# Altium schematic sheet main.SchDoc
size A4
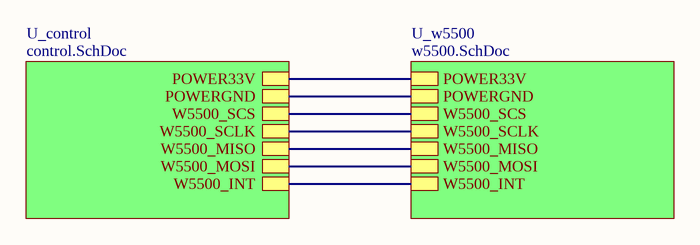
[diagram p0: main.SchDoc]

## Sub-sheets
U_control = control.SchDoc: POWER33V, POWERGND, W5500_INT, W5500_SCS, W5500_SCLK, W5500_MISO, W5500_MOSI
U_w5500 = w5500.SchDoc: POWERGND, POWER33V, W5500_SCS, W5500_SCLK, W5500_MISO, W5500_MOSI, W5500_INT

## Nets
(unnamed): sheet U_control/POWER33V, sheet U_w5500/POWER33V
(unnamed): sheet U_control/POWERGND, sheet U_w5500/POWERGND
(unnamed): sheet U_control/W5500_INT, sheet U_w5500/W5500_INT
(unnamed): sheet U_control/W5500_SCS, sheet U_w5500/W5500_SCS
(unnamed): sheet U_control/W5500_SCLK, sheet U_w5500/W5500_SCLK
(unnamed): sheet U_control/W5500_MISO, sheet U_w5500/W5500_MISO
(unnamed): sheet U_control/W5500_MOSI, sheet U_w5500/W5500_MOSI